# Altium schematic sheet Power_adacus_sch.SchDoc
size A4; SheetNumber: 1; SheetTotal: 4
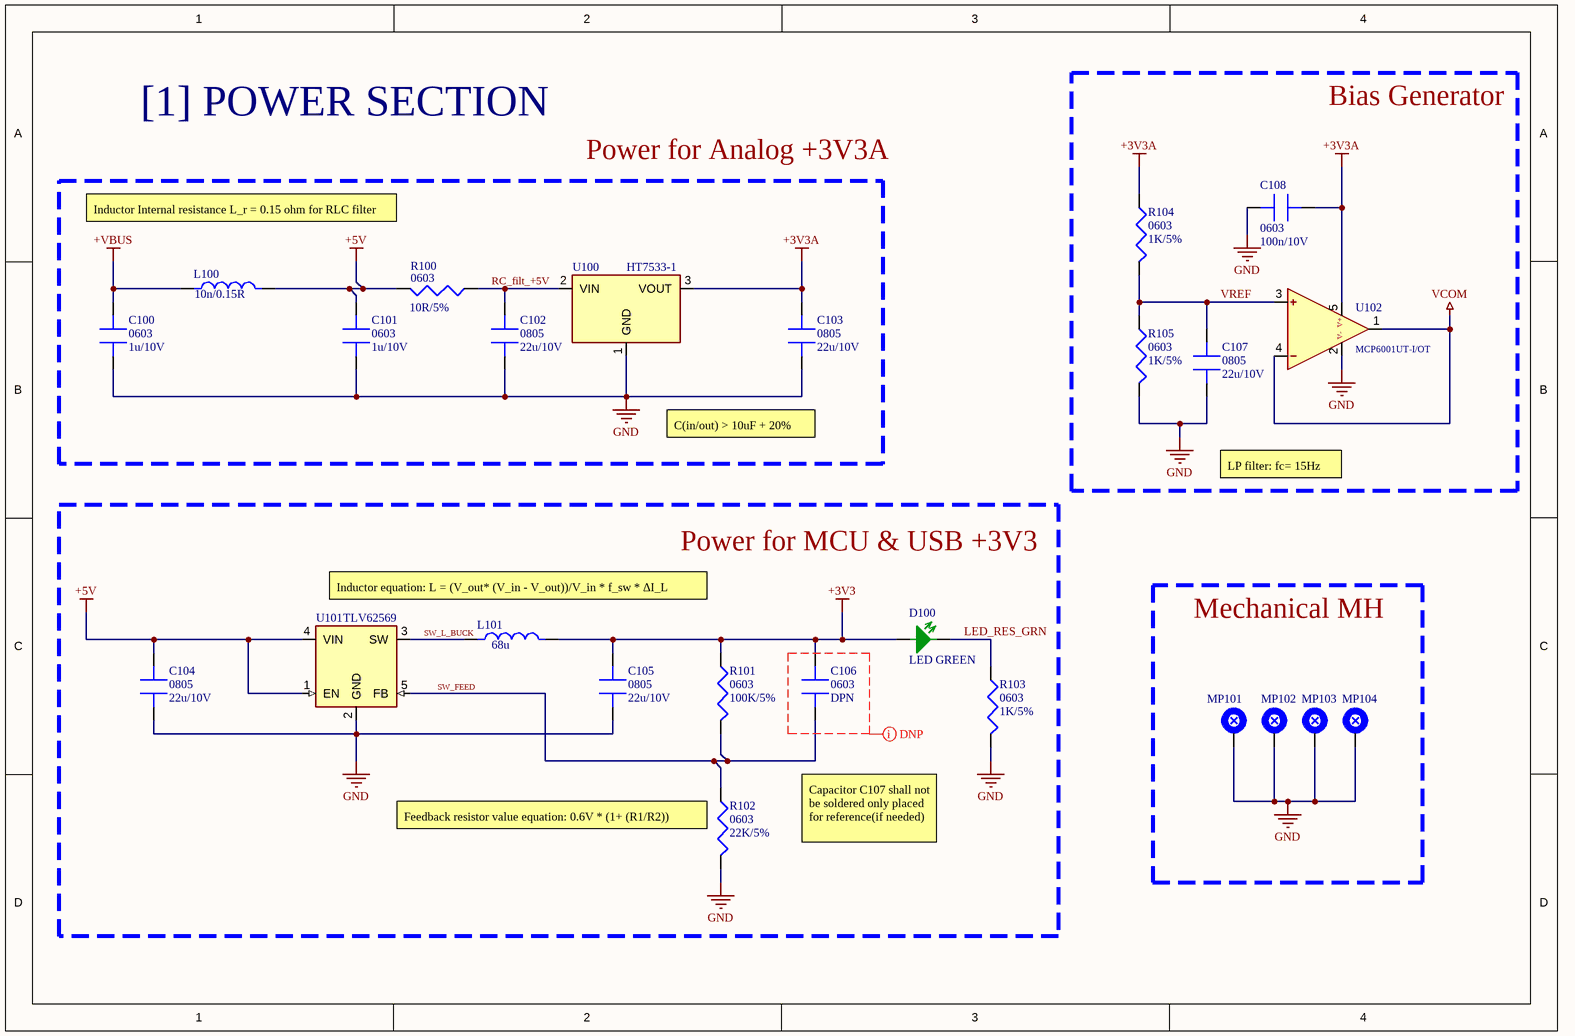
[diagram p0: Power_adacus_sch.SchDoc]

## Parts
C100  value 1u/10V  Package: 0603  [[0603] CAPC1608X10M [A-LD]]  (hidden comment: Capacitor)
C101  value 1u/10V  Package: 0603  [[0603] CAPC1608X10M [A-LD]]  (hidden comment: Capacitor)
C102  value 22u/10V  Package: 0805  [[0805] CAPC2012X09M [A - LD]]  (hidden comment: Capacitor)
C103  value 22u/10V  Package: 0805  [[0805] CAPC2012X09M [A - LD]]  (hidden comment: Capacitor)
C104  value 22u/10V  Package: 0805  [[0805] CAPC2012X09M [A - LD]]  (hidden comment: Capacitor)
C105  value 22u/10V  Package: 0805  [[0805] CAPC2012X09M [A - LD]]  (hidden comment: Capacitor)
C106  value DPN  Package: 0603  [[0603] CAPC1608X10M [A-LD]]  (hidden comment: Capacitor)
C107  value 22u/10V  Package: 0805  [[0805] CAPC2012X09M [A - LD]]  (hidden comment: Capacitor)
C108  value 100n/10V  Package: 0603  [[0603] CAPC1608X10M [A-LD]]  (hidden comment: Capacitor)
D100  LED GREEN  [LEDC2012X120N]
L100  value 10n/0.15R  [PM0603-10NJ]  (hidden comment: Inductor)
L101  value 68u  [[L] SPM10054T-680M-HZR]  (hidden comment: Inductor)
MP101  Mounting hole  [Mounting_hole_M3]  (value not drawn)
MP102  Mounting hole  [Mounting_hole_M3]  (value not drawn)
MP103  Mounting hole  [Mounting_hole_M3]  (value not drawn)
MP104  Mounting hole  [Mounting_hole_M3]  (value not drawn)
R100  value 10R/5%  Package: 0603  [[0603] RESC1608X06M [A-LD]]  (hidden comment: Resistor)
R101  value 100K/5%  Package: 0603  [[0603] RESC1608X06M [A-LD]]  (hidden comment: Resistor)
R102  value 22K/5%  Package: 0603  [[0603] RESC1608X06M [A-LD]]  (hidden comment: Resistor)
R103  value 1K/5%  Package: 0603  [[0603] RESC1608X06M [A-LD]]  (hidden comment: Resistor)
R104  value 1K/5%  Package: 0603  [[0603] RESC1608X06M [A-LD]]  (hidden comment: Resistor)
R105  value 1K/5%  Package: 0603  [[0603] RESC1608X06M [A-LD]]  (hidden comment: Resistor)
U100  HT7533-1  [SOT89-150P354X160-3M]
U101  TLV62569  [SOT95P280X145-5M]
U102  MCP6001UT-I/OT  [SOT95P270X145-5M]

## Blocks framed on the sheet
Bias Generator: C107 C108 R104 R105 U102
Power for Analog +3V3A: C100-C103 L100 R100 U100
Power for MCU & USB +3V3: C104-C106 D100 L101 R101-R103 U101
Mechanical MH: MP101-MP104

## Nets
+3V3: C105.2 C106.2 D100.1 L101.1 R101.2
+3V3A: C103.2 C108.1 R104.2 U100.3(VOUT) U102.5(VDD)
+5V: C101.2 C104.2 L100.1 R100.1 U101.1(EN) U101.4(VIN)
+VBUS: C100.2 L100.2
GND: C100.1 C101.1 C102.1 C103.1 C104.1 C105.1 C107.1 C108.2 MP101.1 MP102.1 MP103.1 MP104.1 R102.1 R103.1 R105.1 U100.1(GND) U101.2(GND) U102.2(VSS)
VCOM: U102.1(OUT) U102.4(-)
LED_RES_GRN: D100.2 R103.2
RC_filt_+5V: C102.2 R100.2 U100.2(VIN)
SW_FEED: C106.1 R101.1 R102.2 U101.5(FB)
SW_L_BUCK: L101.2 U101.3(SW)
VREF: C107.2 R104.1 R105.2 U102.3(+)

## Layout directives
mark named DNP: (no net found under the mark)

## Notes on the sheet
- [1] POWER SECTION
- Inductor Internal resistance L_r = 0.15 ohm for RLC filter
- C(in/out) > 10uF + 20%
- LP filter: fc= 15Hz
- Inductor equation: L = (V_out* (V_in - V_out))/V_in * f_sw * ΔI_L
- (near R102) Feedback resistor value equation: 0.6V * (1+ (R1/R2))
- Capacitor C107 shall not be soldered only placed for reference(if needed)
- DWG. NO.
- REV.
- SHT.
- REVISION
- DESCRIPTION
- DATE
- APPROVED
- THIS DOCUMENT AND THE DATA DISCLOSED HEREIN OR HEREWITH IS THE PROPERTY OF ALTIUM LIMITED AND MAY BE FREELY DISTRIBUTED IN WHOLE. NO RIGHTS ARE RESERVED OR EXPRESS OR IMPLIED WARANTEE GIVEN.
- ENG:
- DSN:
- APPROVALS
- PROJECT
- DOCUMENT REVISION:
- DESIGN ITEM:
- CHK:
- BOM:
- REFERENCE DOCUMENTS
- PROJECT REVISION:
- TITLE
- FAB DWG:
- PCB DWG:
- ASSY DWG:
- SCALE:
- SIZE
- C
- CAGE CODE
- FILE NAME
- DWG NO.
- SHEET
- OF
- REV
- (in symbol MCP6001UT-I/OT) V+; V-

## Library data of the parts
C100-C108 = Capacitor: Standard Capacitor
D100 = LED GREEN: Standard LED. Green color
L100 L101 = Inductor: Standard Inductor
  L100: Datasheet: https://product.tdk.com/system/files/dam/doc/product/inductor/inductor/smd/catalog/inductor_automotive_power_spm10054-hzr_en.pdf; Supply Link: https://www.mouser.pl/ProductDetail/TDK/SPM10054T-680M-HZR?qs=amGC7iS6iy%252BIJTKFZp9jOQ%3D%3D
R100-R105 = Resistor: Standard Resistor
U100 = HT7533-1: 100mA TinyPower LDO; Datasheet: https://datasheet.lcsc.com/lcsc/1811062113_Holtek-Semicon-HT7533-1_C14289.pdf
U101 = TLV62569: 2-A High Efficiency Synchronous Buck Converter in SOT Package; Datasheet: https://www.ti.com/lit/ds/symlink/tlv62569.pdf?ts=1697901280609&ref_url=https%253A%252F%252Fwww.google.com%252F
U102 = MCP6001UT-I/OT: Operational Amplifiers - Op Amps Single 1.8V 1MHz; Supplier: https://eu.mouser.com/ProductDetail/Microchip-Technology/MCP6001UT-I-OT?qs=Sez7gRs8XSU2iw24kVuIOw%3D%3D; Datasheet: https://eu.mouser.com/datasheet/2/268/MCHP_S_A0009381759_1-2520804.pdf